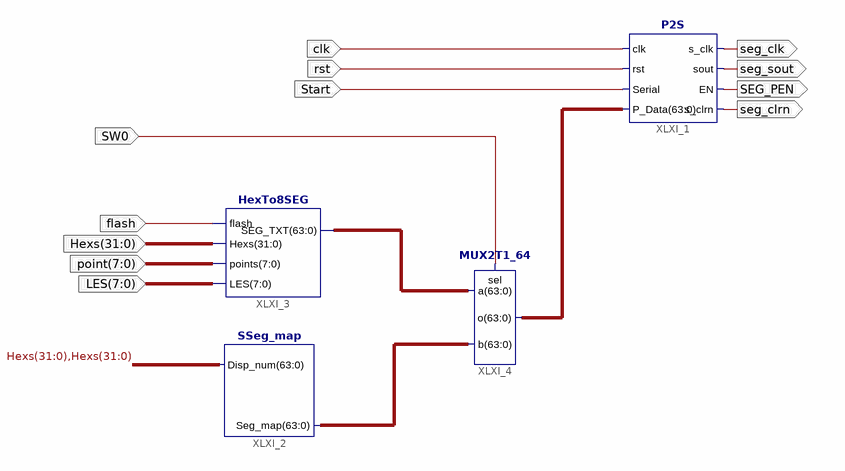
[diagram p0: schematic sheet 1]
// Xilinx ISE schematic SSeg7_Dev.sch (kintex7) as structural Verilog: 4 symbols, 12 ports
module SSeg7_Dev (
  input  SW0,
  input  flash,
  input  [31:0] Hexs,
  input  [7:0] point,
  input  [7:0] LES,
  input  Start,
  input  rst,
  input  clk,
  output seg_clk,
  output seg_sout,
  output SEG_PEN,
  output seg_clrn
);

  wire [63:0] XLXN_1, XLXN_2, XLXN_3;

  P2S XLXI_1 (
    .s_clrn(seg_clrn), .sout(seg_sout), .rst(rst), .EN(SEG_PEN), .Serial(Start), .clk(clk), .s_clk(seg_clk),
    .P_Data(XLXN_3));
  SSeg_map XLXI_2 (.Disp_num({Hexs, Hexs}), .Seg_map(XLXN_2));
  HexTo8SEG XLXI_3 (.flash(flash), .LES(LES), .points(point), .Hexs(Hexs), .SEG_TXT(XLXN_1));
  MUX2T1_64 XLXI_4 (.b(XLXN_2), .sel(SW0), .a(XLXN_1), .o(XLXN_3));
endmodule
